# EAGLE design v11 (EAGLE 7.7.0)
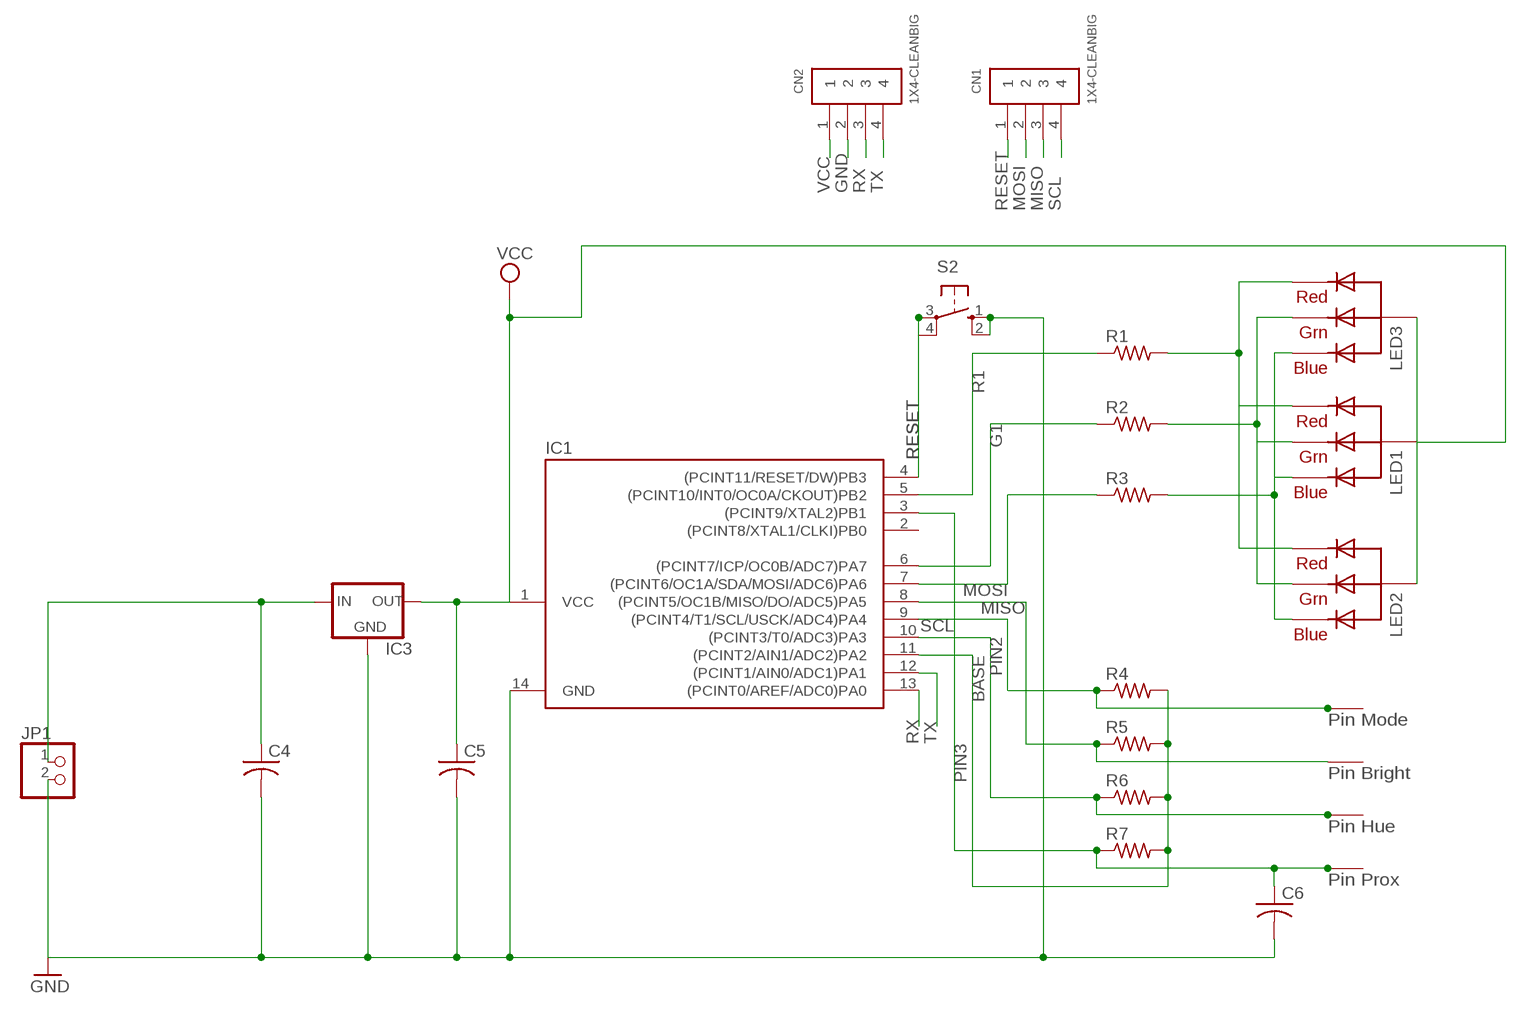
[diagram p0: schematic, sheet 1]

## Parts
2  TOUCH  [RENG]
C4  C-USC0603  [C0603]
C5  C-USC0603  [C0603]
C6  C-USC0603  [C0603]
CN1  1X4-CLEANBIG  [1X04-CLEANBIG]
CN2  1X4-CLEANBIG  [1X04-CLEANBIG]
IC1  TINY24/44/84-PU  [DIL14]
IC3  78LXX  [78LXX]
JP1  PINHD-1X2/90  [1X02/90]
LED1  RGBLED_CA-5MM  [LED5MMRGB]
LED2  RGBLED_CA-5MM  [LED5MMRGB]
LED3  RGBLED_CA-5MM  [LED5MMRGB]
PIN_PROX  TOUCH  [RENG]
PROX_PIN  TOUCH  [RENG]
R1  R-US_R0603  [R0603]
R2  R-US_R0603  [R0603]
R3  R-US_R0603  [R0603]
R4  R-US_R0603  [R0603]
R5  R-US_R0603  [R0603]
R6  R-US_R0603  [R0603]
R7  R-US_R0603  [R0603]
S2  10-XX  [B3F-10XX]
U$3  TOUCH  [RENG]

## Nets
B: LED1.4(BLUE) LED2.4(BLUE) LED3.4(BLUE) R3.2
BASE: IC1.11((PCINT2/AIN1/ADC2)PA2) R4.2 R5.2 R6.2 R7.2
G: LED1.3(GREEN) LED2.3(GREEN) LED3.3(GREEN) R2.2
G1: IC1.6((PCINT7/ICP/OC0B/ADC7)PA7) R2.1
GND: C4.2 C5.2 C6.2 CN2.2 IC1.14(GND) IC3.GND JP1.2 S2.1(S) S2.2(S1)
MISO: 2.T CN1.3 IC1.8((PCINT5/OC1B/MISO/DO/ADC5)PA5) R5.1
MOSI: CN1.2 IC1.7((PCINT6/OC1A/SDA/MOSI/ADC6)PA6) R3.1
N$2: C4.1 IC3.IN JP1.1
PIN2: IC1.10((PCINT3/T0/ADC3)PA3) R6.1 U$3.T
PIN3: C6.1 IC1.3((PCINT9/XTAL2)PB1) PROX_PIN.T R7.1
R: LED1.1(RED) LED2.1(RED) LED3.1(RED) R1.2
R1: IC1.5((PCINT10/INT0/OC0A/CKOUT)PB2) R1.1
RESET: CN1.1 IC1.4((PCINT11/RESET/DW)PB3) S2.3(P)
RX: CN2.3 IC1.13((PCINT0/AREF/ADC0)PA0)
SCL: CN1.4 IC1.9((PCINT4/T1/SCL/USCK/ADC4)PA4) PIN_PROX.T R4.1
TX: CN2.4 IC1.12((PCINT1/AIN0/ADC1)PA1)
VCC: C5.1 CN2.1 IC1.1(VCC) IC3.OUT LED1.2(VCC) LED2.2(VCC) LED3.2(VCC)
Unconnected: IC1.2((PCINT8/XTAL1/CLKI)PB0) S2.4(P1)

## Notes on the sheet
- Pin Mode
- Pin Bright
- Pin Hue
- Pin Prox

## Library data of the parts
2 PIN_PROX PROX_PIN U$3 = madebyreng:TOUCH
C4-C6 = adafruit:C-US: CAPACITOR, American symbol
CN1 CN2 = adafruit:1X4: 4-pin connector
IC1 = atmega-atxmega:TINY24/44/84: • High Performance, Low Power AVR® 8-bit Microcontroller • Advanced RISC Architecture – 120 Powerful Instructions – Most Single Clock Cycle Execution – 32 x 8 General Purpose Working Registers – Fully Static Operation • High Endurance, Non-volatile Memory Segments – 2K/4K/8K Bytes of In-System, Self-programmable Flash Program Memory • Endurance: 10,000 Write/Erase Cycles – 128/256/512 Bytes of In-System Programmable EEPROM • Endurance: 100,000 Write/Erase Cycles – 128/256/512 Bytes of Internal SRAM – Data Retention: 20 years at 85°C / 100 years at 25°C – Programming Lock for Self-programming Flash & EEPROM Data Security • Peripheral Features – One 8-bit and One 16-bit Timer/Counter with Two PWM Channels, Each – 10-bit ADC • 8 Single-ended Channels • 12 Differential ADC Channel Pairs with Programmable Gain (1x / 20x) – Programmable Watchdog Timer with Separate On-chip Oscillator – On-chip Analog Comparator – Universal Serial Interface • Special Microcontroller Features – debugWIRE On-chip Debug System – In-System Programmable via SPI Port – Internal and External Interrupt Sources • Pin Change Interrupt on 12 Pins – Low Power Idle, ADC Noise Reduction, Standby and Power-down Modes – Enhanced Power-on Reset Circuit – Programmable Brown-out Detection Circuit with Software Disable Function – Internal Calibrated Oscillator – On-chip Temperature Sensor • I/O and Packages – Available in 20-pin QFN/MLF/VQFN, 14-pin SOIC, 14-pin PDIP and 15-ball UFBGA – Twelve Programmable I/O Lines • Operating Voltage: – 1.8 – 5.5V • Speed Grade: – 0 – 4 MHz @ 1.8 – 5.5V – 0 – 10 MHz @ 2.7 – 5.5V – 0 – 20 MHz @ 4.5 – 5.5V • Industrial Temperature Range: -40°C to +85°C • Low Power Consumption – Active Mode: • 210 μA at 1.8V and 1 MHz – Idle Mode: • 33 μA at 1.8V and 1 MHz – Power-down Mode: • 0.1 μA at 1.8V and 25°C
IC3 = v-reg:78LXX: VOLTAGE REGULATOR
JP1 = pinhead:PINHD-1X2: PIN HEADER
LED1-LED3 = adafruit:RGBLED_CA: RGB LED, common-anode 5MM Staggered pins 5mm Piranha package http://www.ladyada.net/library/pcb/eaglelibrary.html
R1-R7 = adafruit:R-US_: RESISTOR, American symbol
S2 = switch-omron:10-XX: OMRON SWITCH; MPN: B3F-1000; OC_FARNELL: 176432; OC_NEWARK: 36M3542

## Board
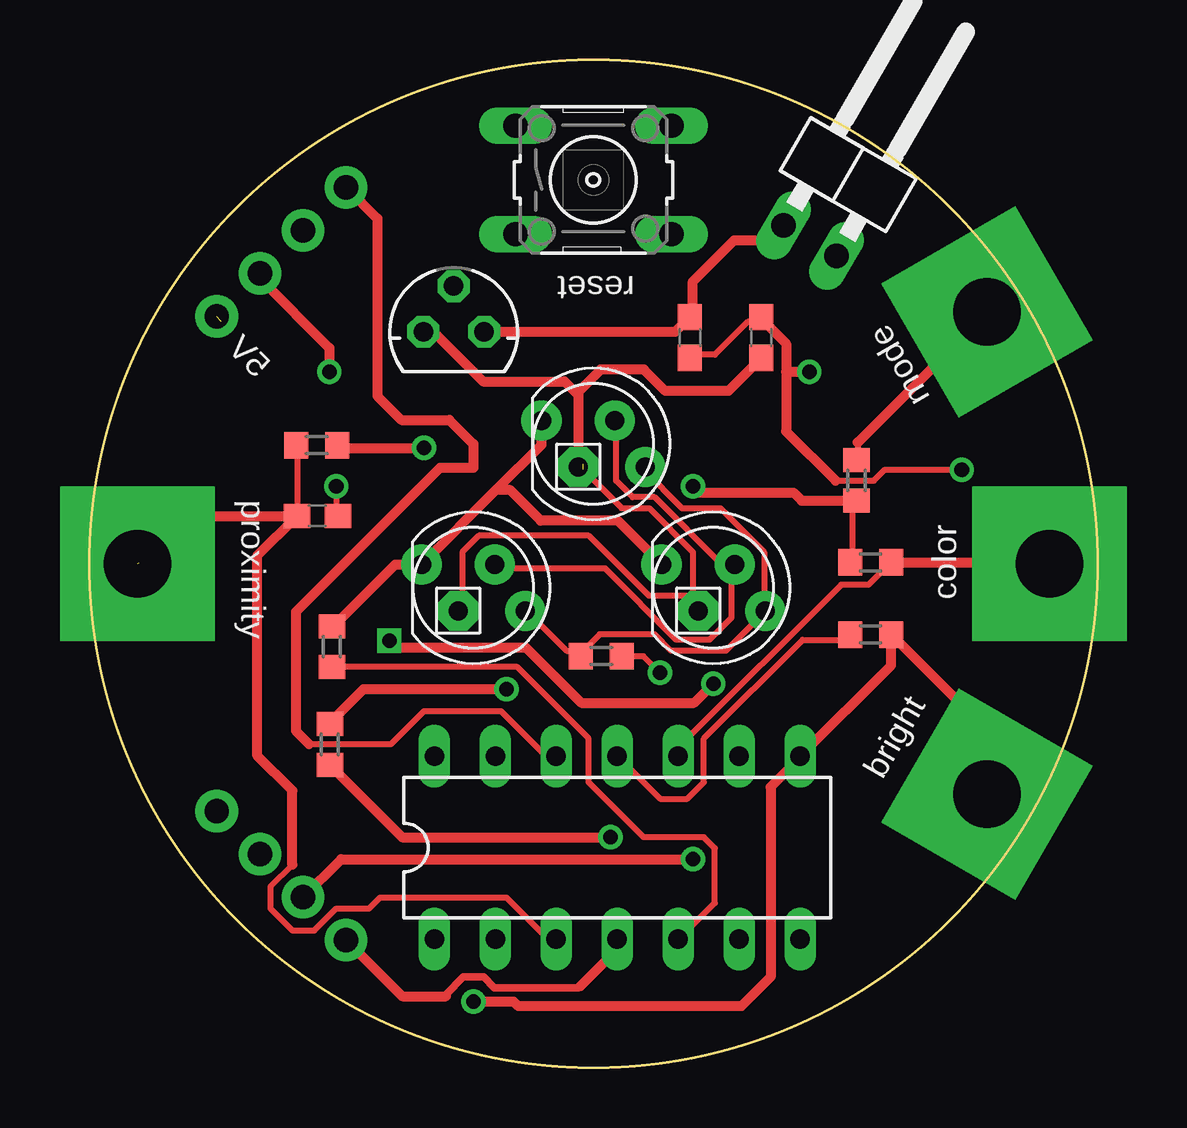
[diagram p1: board, top side]
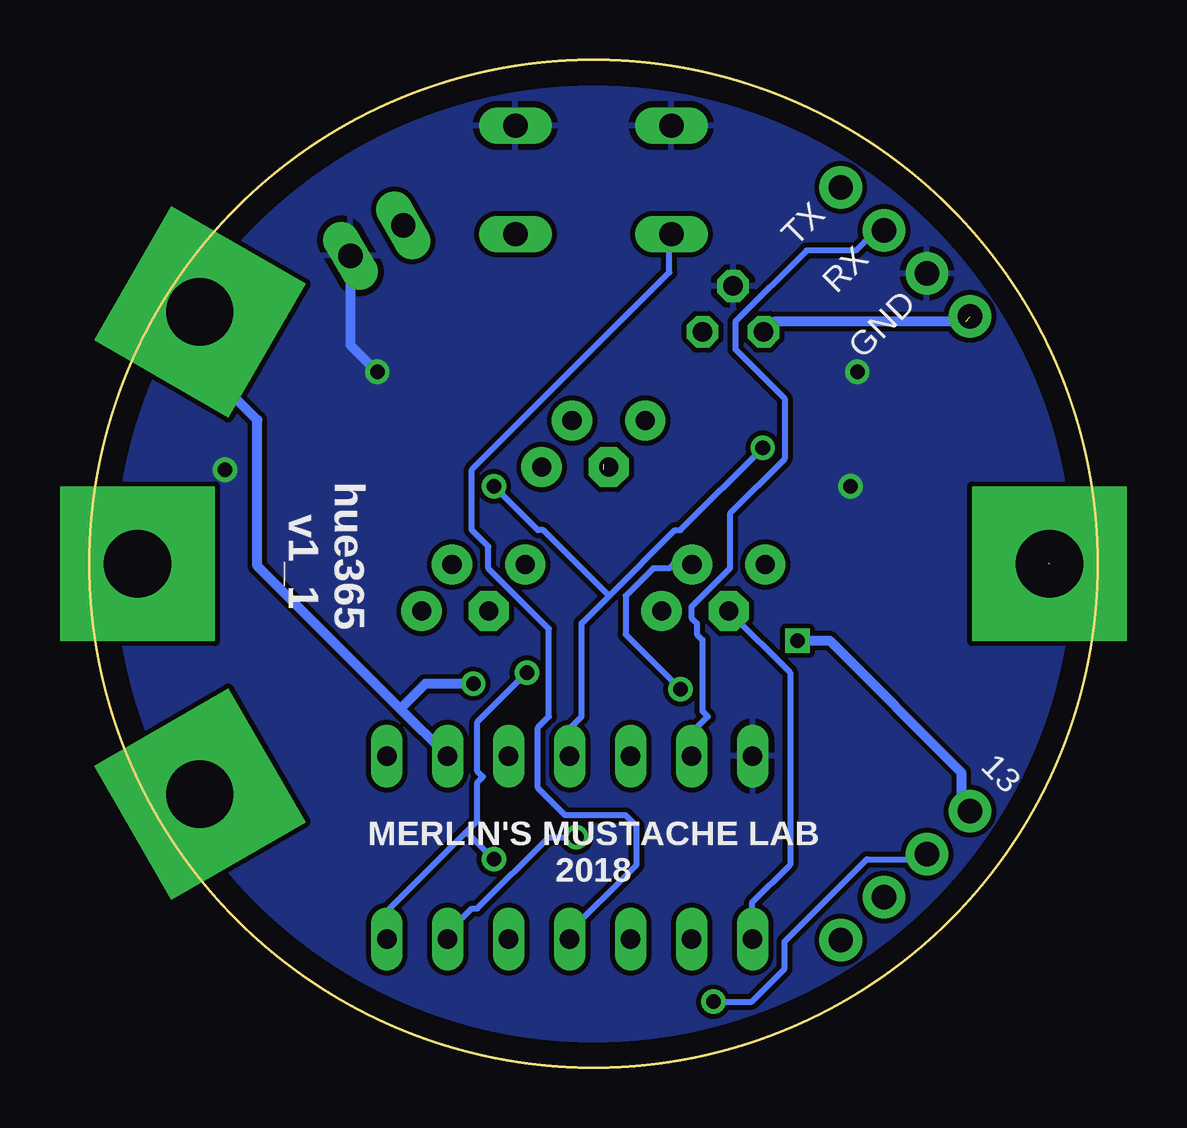
[diagram p2: board, bottom side, seen from below]

Size 42 x 42 mm. Coordinates in mm from the lower left corner, seen from the top.
Outline: circle at 21,21 radius 21
Copper layers (1*16): Top 0.035mm / dielectric 1.5mm / Bottom 0.035mm
Design rules "default": minimum track width 10mil, minimum drill 24mil, track to track 8mil, track to pad 8mil, pad to pad 8mil, via to via 8mil, smd to smd 8mil, copper to edge 40mil, drill to drill 8mil, minimum pad ring 10mil, minimum via ring 8mil, stop-mask expansion 4mil, vias tented up to drill 0mil, thermal gap 10mil

### Footprints (pad centres in the part's own frame; a part is rotated, then mirrored left to right if it is on the bottom)
RENG = drill 2.8 pad 6.452 square: T 0,0
C0603 = smd 1.1 x 1: 1 -0.85,0; 2 0.85,0
1X04-CLEANBIG = drill 1.016 pad 1.778: 1 -3.81,0; 2 -1.27,0; 3 1.27,0; 4 3.81,0
DIL14 = drill 0.813 long: 1 -7.62,-3.81; 2 -5.08,-3.81; 3 -2.54,-3.81; 4 0,-3.81; 5 2.54,-3.81; 6 5.08,-3.81; 7 7.62,-3.81; 8 7.62,3.81; 9 5.08,3.81; 10 2.54,3.81; 11 0,3.81; 12 -2.54,3.81; 13 -5.08,3.81; 14 -7.62,3.81
78LXX = drill 0.813 octagon: GND 0,1.905; IN 1.27,0; OUT -1.27,0
1X02/90 = drill 1.016 long: 1 -1.27,-3.81; 2 1.27,-3.81
LED5MMRGB = drill 0.8 pad 1.676: 1 -2.159,0.968; 3 0.889,0.968; 4 2.159,-0.968 | drill 0.8 pad 1.676 octagon: 2 -0.635,-0.968
R0603 = smd 1 x 1.1: 1 -0.85,0; 2 0.85,0
B3F-10XX = drill 1.016 long: 1 -3.251,2.261; 2 3.251,2.261; 3 -3.251,-2.261; 4 3.251,-2.261

### Placement (x,y rotation side)
2  37.4,11.4 60 top
C4  25.01,30.43 270 top
C5  28,30.43 90 top
C6  9.5,23 0 top
CN1  8,8 135 top
CN2  8,34 45 top
IC1  21.99,9.17 0 top
IC3  15.18,30.67 0 top
JP1  31.93,37.77 330 top
LED1  16,20 0 top
LED2  26,20 0 top
LED3  21,26 0 top
PIN_PROX  37.4,31.5 30 top
PROX_PIN  2,21 0 top
R1  10.1,17.54 90 top
R2  10.02,13.47 90 top
R3  21.33,17.15 180 top
R4  31.96,24.48 270 top
R5  32.55,18.05 180 top
R6  32.55,21.06 180 top
R7  9.47,25.94 0 top
S2  21,37 0 top
U$3  40,21 0 top

### Tracks (layer width: path | path; a pad name or v marks a point on that pad's centre or on a via)
B
  Top 0.254: LED1.4 18.29,18.97 19.89,17.37 20.34,17.37 R3.2 20.57,17.37 21.26,18.06 23.55,18.06 24.23,17.37 26.52,17.37 28.12,18.97 LED2.4 28.12,19.2 28.12,21.49 26.29,23.32 24.69,23.32 23.09,24.92 LED3.4
BASE  (via drill 0.61)
  Top 0.254: R6.2 31.77,21.26 31.77,23.55 R4.2 31.77,23.77 | 10.52,25.83 R7.2 | R5.2 31.55,17.83 29.72,17.83 25.6,13.72 25.6,11.89 24.92,11.2 23.77,11.2 22.17,12.8 IC1.11
  Top 0.406: 10.52,25.83 v13.95,25.83 | v25.15,24.23 25.41,23.96 29.34,23.96 29.67,23.63 R4.2
  Bottom 0.254: v13.95,25.83 17.37,22.4 17.6,22.4 20.34,19.66 | 20.34,19.66 21.49,18.52 21.49,14.63 21.95,14.17 21.95,13.03 IC1.11 | v25.15,24.23 23.32,22.4 23.09,22.4 20.34,19.66
G  (via drill 0.61)
  Top 0.254: 10.06,14.4 R2.2 | LED3.3 21.95,26.75 21.95,24.46 22.63,23.77 23.55,23.77 26.29,21.03 26.75,21.03 LED2.3 26.75,20.8 26.75,18.75 25.83,17.83 24.46,17.83 21.49,20.8 16.92,20.8 LED1.3
  Top 0.406: 10.06,14.4 11.43,15.77 v17.37,15.77
  Bottom 0.254: v17.37,15.77 19.66,18.06 19.66,19.66 18.52,20.8 17.83,20.8 17.6,21.03 16.92,21.03 LED1.3
G1  (via drill 0.61)
  Top 0.254: 10.06,12.57 R2.1
  Top 0.406: 10.06,12.57 13.03,9.6 v21.72,9.6
  Bottom 0.254: v21.72,9.6 22.86,9.6 25.83,6.63 26.06,6.63 27.2,5.49 IC1.6
GND  (via drill 0.6, 0.61)
  Top 0.254: v10.29,24.23 10.29,23.09 C6.2 | C4.2 25.15,29.72 26.06,29.72 27.43,31.09 27.89,31.09 C5.2 28.12,31.09 | v36.35,24.92 33.15,24.92 32.69,24.46 31.09,24.46
  Top 0.406: CN2.2 7.1,32.9 10,30 v10,29 | v30,29 29.03,29 | 28.12,31.09 29.03,30.18 29.03,29 | 29.03,29 29.03,26.52 31.09,24.46
  Bottom 0.406: v30,29 31.12,30.12 JP1.2
  pour Bottom: 0,21 arc-180 42,21 arc-180
MISO  (via drill 0.61)
  Top 0.254: 29.49,12.8 IC1.8
  Top 0.406: 2.T 37.4,14.05 R5.1 33.4,16.77 IC1.8 | 29.49,12.8 28.38,11.7 28.38,3.77 27.16,2.55 17.87,2.55 17.68,2.74 v16,2.74
  Bottom 0.254: v16,2.74 14.4,2.74 13.03,4.12 13.03,5.26 9.6,8.69 7.32,8.69 CN1.3
MOSI  (via drill 0.61)
  Top 0.254: v23.77,16.46 23.09,17.14 22.4,17.14 R3.1
  Top 0.406: CN1.2 10.48,8.69 v25.15,8.69
  Bottom 0.254: v23.77,16.46 25.83,14.4 25.83,12.34 25.6,12.12 25.83,11.89 25.83,10.29 26.29,9.83 | 26.29,9.83 29.49,6.63 29.49,5.49 IC1.7 | 26.29,9.83 v25.15,8.69
N$2
  Top 0.254: 25.15,31.32 C4.1
  Top 0.406: IC3.IN 24.4,30.67 C4.1 | 25.15,31.32 25.15,32.77 26.86,34.48 28.3,34.48 JP1.1
PIN2
  Top 0.254: IC1.10 24.69,13.03 24.69,13.49 31.32,20.12 32.46,20.12 33.38,21.03 R6.1
  Top 0.406: R6.1 39.94,21.06 U$3.T
PIN3  (1 unrouted)
  Top 0.254: R7.1 8.69,25.83 8.69,23.09 C6.1 8.46,22.86 | 8.46,8.46 7.54,7.54 7.54,6.63 8.46,5.71 9.37,5.71 10.29,6.63 11.66,6.63 12.12,7.09 17.37,7.09 18.97,5.49 19.43,5.49 IC1.3
  Top 0.406: 2.06,21.03 2.06,21.06 4,23 C6.1 7,21.35 7,13 8.46,11.54 8.46,8.46
R
  Top 0.254: 10.29,18.52 R1.2
  Top 0.406: 10.29,18.52 12.74,20.97 LED1.1 16.94,24.06 | 16.94,24.06 18.84,25.97 LED3.1 | LED2.1 22.01,22.8 18.8,22.8 17.54,24.06 16.94,24.06
R1
  Top 0.254: R1.1 10.29,16.69 17.83,16.69 20.8,13.72 20.8,11.89 23.09,9.6 25.6,9.6 26.06,9.14 26.06,6.86 24.69,5.49 IC1.5
RESET
  Top 0.305: 14.86,2.97 14.86,3.05 15.58,3.77 16.42,3.77 16.88,3.31 20.38,3.31 20.46,3.39
  Top 0.406: CN1.1 13.03,2.97 14.86,2.97 | 20.46,3.39 21.99,4.92 IC1.4
  Bottom 0.254: S2.3 17.83,34.52 17.83,33.15 26.06,24.92 26.06,22.4 25.38,21.72 25.38,20.8 22.86,18.29 22.86,14.63 23.32,14.17 23.32,11.66 22.17,10.52 19.66,10.52 19.2,10.06 19.2,8.46 22.17,5.49 IC1.4
RX
  Bottom 0.254: IC1.13 16.69,13.03 16.69,14.17 16.23,14.63 16.46,14.86 16.46,17.83 16.69,18.06 16.69,18.52 16.92,18.75 16.92,19.2 15.32,20.8 15.32,23.09 13.03,25.38 13.03,27.89 15.09,29.95 15.09,31.09 12.12,34.06 10.06,34.06 9.37,34.75 8.91,34.75 CN2.3
SCL  (via drill 0.6)
  Top 0.254: R4.1 32,25.38 32,26.06 | 37.26,31.32 PIN_PROX.T
  Top 0.406: 32,26.06 37.4,31.46 PIN_PROX.T | v26,16 25.2,15.2 20.5,15.2 18.2,17.5 12.79,17.5 v12.5,17.79
  Bottom 0.406: IC1.9 29.05,14.96 | 29.05,14.96 35,20.91 35,27 37.4,29.4 PIN_PROX.T | v26,16 28,16 29.05,14.96 | v12.5,17.79 11.16,17.79 5.68,12.31 5.68,11.06 CN1.4
TX
  Top 0.254: 9.14,13.49 12.57,13.49 13.95,14.86 17.14,14.86 18.97,13.03 19.43,13.03 IC1.12
  Top 0.406: CN2.4 12,35.39 12,28 13,27 15,27 16,26 16,25 14.6,25 8.6,19 8.6,14.03 9.14,13.49
VCC  (2 unrouted)
  Top 0.254: 20.57,25.15 LED3.2 | 25.15,19.66 25.15,21.49 23.32,23.32 22.17,23.32 20.57,24.92 | 25.15,19.66 25.15,19.2 LED2.2 25.15,19.66 | 25.15,19.66 23.32,19.66 20.8,22.17 16.23,22.17 15.54,21.49 15.54,19.2 LED1.2
  Top 0.406: IC3.OUT 14.33,30.67 16.4,28.6 19.8,28.6 20.36,28.04 | 20.36,28.04 LED3.2 | C5.1 26.62,28.2 24,28.2 23.1,29.1 21.3,29.1 20.36,28.16 20.36,28.04
  Bottom 0.254: IC1.1 14.4,5.49 14.4,6.86 12.8,8.46 12.8,16.46 15.32,18.97 LED1.2
  Bottom 0.406: 5.49,31.09 13.49,31.09 IC3.OUT

### Text on the board
tNames: reset | 5V | mode | proximity | color | bright
bNames: TX | RX | GND | hue365 / v1_1 | 13 | MERLIN'S MUSTACHE LAB / 2018